# EAGLE schematic MIDILodica (EAGLE 9.7.0)
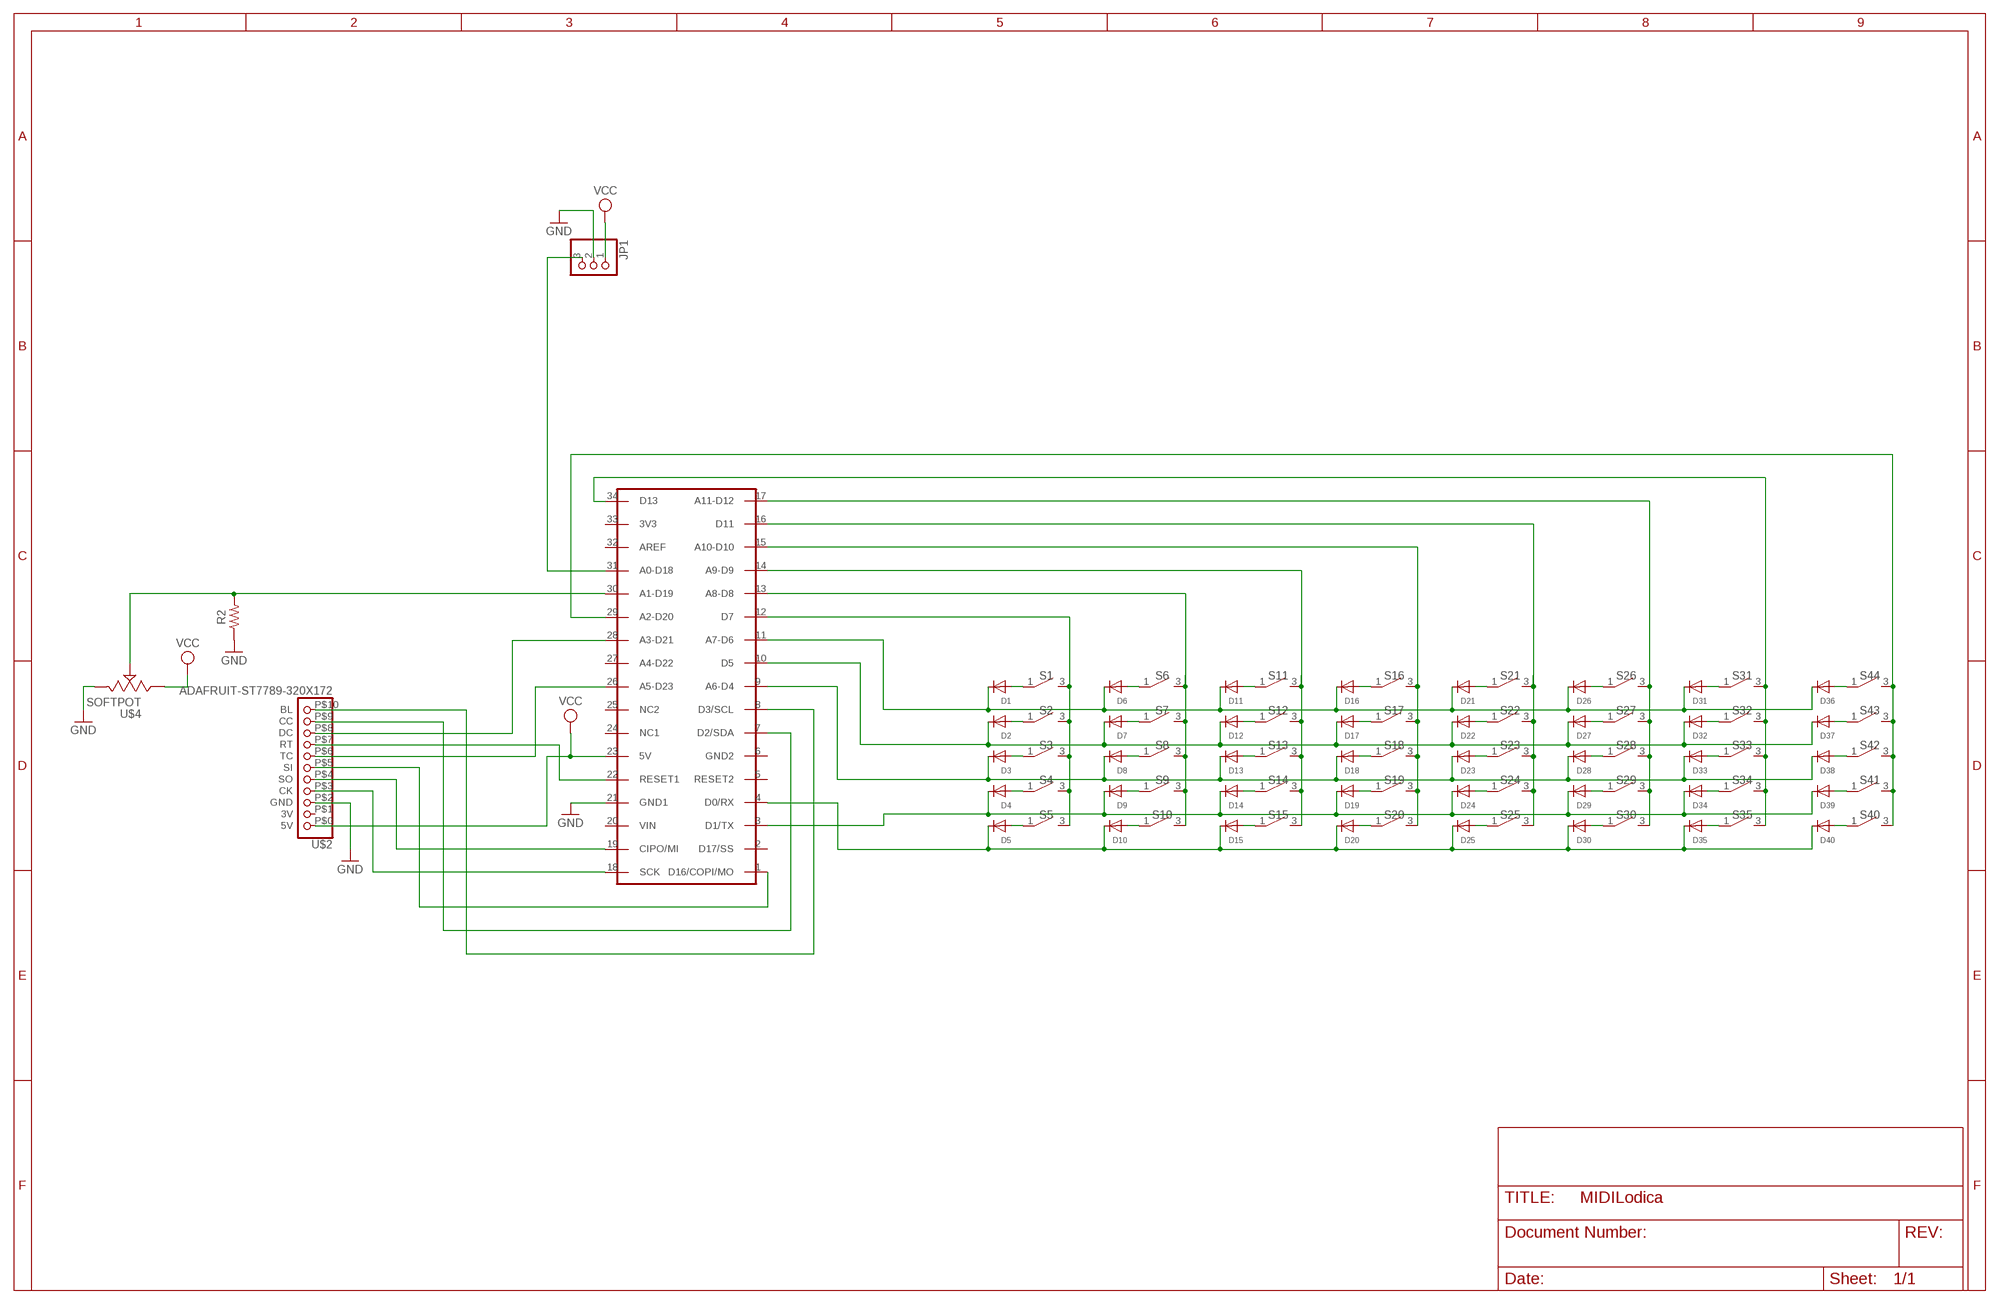
[diagram p0: schematic, sheet 1]

## Parts
D1  DIODEDO-1N4148  [DO-1N4148]
D2  DIODEDO-1N4148  [DO-1N4148]
D3  DIODEDO-1N4148  [DO-1N4148]
D4  DIODEDO-1N4148  [DO-1N4148]
D5  DIODEDO-1N4148  [DO-1N4148]
D6  DIODEDO-1N4148  [DO-1N4148]
D7  DIODEDO-1N4148  [DO-1N4148]
D8  DIODEDO-1N4148  [DO-1N4148]
D9  DIODEDO-1N4148  [DO-1N4148]
D10  DIODEDO-1N4148  [DO-1N4148]
D11  DIODEDO-1N4148  [DO-1N4148]
D12  DIODEDO-1N4148  [DO-1N4148]
D13  DIODEDO-1N4148  [DO-1N4148]
D14  DIODEDO-1N4148  [DO-1N4148]
D15  DIODEDO-1N4148  [DO-1N4148]
D16  DIODEDO-1N4148  [DO-1N4148]
D17  DIODEDO-1N4148  [DO-1N4148]
D18  DIODEDO-1N4148  [DO-1N4148]
D19  DIODEDO-1N4148  [DO-1N4148]
D20  DIODEDO-1N4148  [DO-1N4148]
D21  DIODEDO-1N4148  [DO-1N4148]
D22  DIODEDO-1N4148  [DO-1N4148]
D23  DIODEDO-1N4148  [DO-1N4148]
D24  DIODEDO-1N4148  [DO-1N4148]
D25  DIODEDO-1N4148  [DO-1N4148]
D26  DIODEDO-1N4148  [DO-1N4148]
D27  DIODEDO-1N4148  [DO-1N4148]
D28  DIODEDO-1N4148  [DO-1N4148]
D29  DIODEDO-1N4148  [DO-1N4148]
D30  DIODEDO-1N4148  [DO-1N4148]
D31  DIODEDO-1N4148  [DO-1N4148]
D32  DIODEDO-1N4148  [DO-1N4148]
D33  DIODEDO-1N4148  [DO-1N4148]
D34  DIODEDO-1N4148  [DO-1N4148]
D35  DIODEDO-1N4148  [DO-1N4148]
D36  DIODEDO-1N4148  [DO-1N4148]
D37  DIODEDO-1N4148  [DO-1N4148]
D38  DIODEDO-1N4148  [DO-1N4148]
D39  DIODEDO-1N4148  [DO-1N4148]
D40  DIODEDO-1N4148  [DO-1N4148]
JP1  PINHD-1X3  [1X03]
R2  R-US_AXIAL-7.2MM-PITCH  [RESAD724W46L381D178B]
S1  TL1105SPF160Q  [TL1105SPF160Q]
S2  TL1105SPF160Q  [TL1105SPF160Q]
S3  TL1105SPF160Q  [TL1105SPF160Q]
S4  TL1105SPF160Q  [TL1105SPF160Q]
S5  TL1105SPF160Q  [TL1105SPF160Q]
S6  TL1105SPF160Q  [TL1105SPF160Q]
S7  TL1105SPF160Q  [TL1105SPF160Q]
S8  TL1105SPF160Q  [TL1105SPF160Q]
S9  TL1105SPF160Q  [TL1105SPF160Q]
S10  TL1105SPF160Q  [TL1105SPF160Q]
S11  TL1105SPF160Q  [TL1105SPF160Q]
S12  TL1105SPF160Q  [TL1105SPF160Q]
S13  TL1105SPF160Q  [TL1105SPF160Q]
S14  TL1105SPF160Q  [TL1105SPF160Q]
S15  TL1105SPF160Q  [TL1105SPF160Q]
S16  TL1105SPF160Q  [TL1105SPF160Q]
S17  TL1105SPF160Q  [TL1105SPF160Q]
S18  TL1105SPF160Q  [TL1105SPF160Q]
S19  TL1105SPF160Q  [TL1105SPF160Q]
S20  TL1105SPF160Q  [TL1105SPF160Q]
S21  TL1105SPF160Q  [TL1105SPF160Q]
S22  TL1105SPF160Q  [TL1105SPF160Q]
S23  TL1105SPF160Q  [TL1105SPF160Q]
S24  TL1105SPF160Q  [TL1105SPF160Q]
S25  TL1105SPF160Q  [TL1105SPF160Q]
S26  TL1105SPF160Q  [TL1105SPF160Q]
S27  TL1105SPF160Q  [TL1105SPF160Q]
S28  TL1105SPF160Q  [TL1105SPF160Q]
S29  TL1105SPF160Q  [TL1105SPF160Q]
S30  TL1105SPF160Q  [TL1105SPF160Q]
S31  TL1105SPF160Q  [TL1105SPF160Q]
S32  TL1105SPF160Q  [TL1105SPF160Q]
S33  TL1105SPF160Q  [TL1105SPF160Q]
S34  TL1105SPF160Q  [TL1105SPF160Q]
S35  TL1105SPF160Q  [TL1105SPF160Q]
S40  TL1105SPF160Q  [TL1105SPF160Q]
S41  TL1105SPF160Q  [TL1105SPF160Q]
S42  TL1105SPF160Q  [TL1105SPF160Q]
S43  TL1105SPF160Q  [TL1105SPF160Q]
S44  TL1105SPF160Q  [TL1105SPF160Q]
U$1  ARDUINO_MICRO  [ARDUINO-MICRO]
U$2  ADAFRUIT-ST7789-320X172  [ADAFRUIT-ST7789-320X172]
U$4  SOFTPOT  [SOFTPOT-1]

## Nets
5V+: JP1.1 U$1.23(5V) U$2.P$0(5V) U$4.1 ; supply symbol labelled VCC
GND: JP1.2 R2.1 U$1.21(GND1) U$2.P$2(GND) U$4.3
N$2: R2.2 U$1.30(A1-D19) U$4.2
N$3: JP1.3 U$1.31(A0-D18)
N$4: D25.A S25.1
N$5: D24.A S24.1
N$6: D23.A S23.1
N$7: U$1.26(A5-D23) U$2.P$6(TC)
N$8: D4.C D9.C D14.C D19.C D24.C D29.C D34.C D39.C U$1.3(D1/TX)
N$9: D22.A S22.1
N$10: D39.A S41.1
N$11: D38.A S42.1
N$12: D37.A S43.1
N$13: D1.A S1.1
N$14: D2.A S2.1
N$15: D3.A S3.1
N$16: D4.A S4.1
N$17: D5.A S5.1
N$18: D10.A S10.1
N$19: D9.A S9.1
N$20: D8.A S8.1
N$21: D7.A S7.1
N$22: D6.A S6.1
N$23: D36.A S44.1
N$24: D21.A S21.1
N$25: S40.3 S41.3 S42.3 S43.3 S44.3 U$1.29(A2-D20)
N$26: D30.A S30.1
N$27: D29.A S29.1
N$28: D28.A S28.1
N$29: U$1.22(RESET1) U$2.P$7(RT)
N$30: D27.A S27.1
N$31: D26.A S26.1
N$32: U$1.28(A3-D21) U$2.P$8(DC)
N$33: D35.A S35.1
N$34: D34.A S34.1
N$35: D11.A S11.1
N$36: D12.A S12.1
N$37: D13.A S13.1
N$38: D14.A S14.1
N$39: D15.A S15.1
N$40: D20.A S20.1
N$41: D19.A S19.1
N$42: D18.A S18.1
N$43: D17.A S17.1
N$44: D16.A S16.1
N$45: D33.A S33.1
N$46: D32.A S32.1
N$47: D31.A S31.1
N$48: U$1.18(SCK) U$2.P$3(CK)
N$49: U$1.19(CIPO/MI) U$2.P$4(SO)
N$50: U$1.7(D2/SDA) U$2.P$9(CC)
N$51: U$1.8(D3/SCL) U$2.P$10(BL)
N$52: U$1.1(D16/COPI/MO) U$2.P$5(SI)
N$53: D1.C D6.C D11.C D16.C D21.C D26.C D31.C D36.C U$1.11(A7-D6)
N$54: D2.C D7.C D12.C D17.C D22.C D27.C D32.C D37.C U$1.10(D5)
N$55: D3.C D8.C D13.C D18.C D23.C D28.C D33.C D38.C U$1.9(A6-D4)
N$56: D5.C D10.C D15.C D20.C D25.C D30.C D35.C D40.C U$1.4(D0/RX)
N$57: D40.A S40.1
N$59: S1.3 S2.3 S3.3 S4.3 S5.3 U$1.12(D7)
N$60: S6.3 S7.3 S8.3 S9.3 S10.3 U$1.13(A8-D8)
N$61: S11.3 S12.3 S13.3 S14.3 S15.3 U$1.14(A9-D9)
N$62: S16.3 S17.3 S18.3 S19.3 S20.3 U$1.15(A10-D10)
N$63: S21.3 S22.3 S23.3 S24.3 S25.3 U$1.16(D11)
N$64: S26.3 S27.3 S28.3 S29.3 S30.3 U$1.17(A11-D12)
N$65: S31.3 S32.3 S33.3 S34.3 S35.3 U$1.34(D13)
Unconnected: U$1.2(D17/SS) U$1.5(RESET2) U$1.6(GND2) U$1.20(VIN) U$1.24(NC1) U$1.25(NC2) U$1.27(A4-D22) U$1.32(AREF) U$1.33(3V3) U$2.P$1(3V)

## Library data of the parts
D1-D40 = adafruit:DIODE: Diode SMADIODE - SMA Surface Mount Package 20V 1A Schottky Diode Digikey: 641-1014-6-ND DO-1N4148 - Through Hole Small Current Diode SOD-123 20V 1 A (.5mV Vf) Schottky Diode - Digikey: MBRX120TPMSCT-ND SOD-323 10V 570mA (.38mV Vf, 3ns) Schottky Diode - Digikey: ZLLS410CT-ND SOD-523 30V 30mA Schottky Diode (RB751S-40TE61) - Digikey: RB751S-40TE61CT-ND SOT23-R/W - SOT23 Package (R = Solder Paste/Reflow Ovens, W = Hand-Soldering) BAT54Film 40V 300mA - Digikey: 497-7162-1-ND
JP1 = adafruit:PINHD-1X3: PIN HEADER
R2 = Resistor:R-US: Resistor Fixed - ANSI; CATEGORY: Resistor; SUB-CATEGORY: Fixed
S1-S35 S40-S44 = Standard:TL1105SPF160Q
U$1 = Standard:ARDUINO_MICRO
U$2 = Standard:ADAFRUIT-ST7789-320X172
U$4 = Standard:SOFTPOT